# EAGLE design SNES-3Chip_MR_QID (EAGLE 6.4)
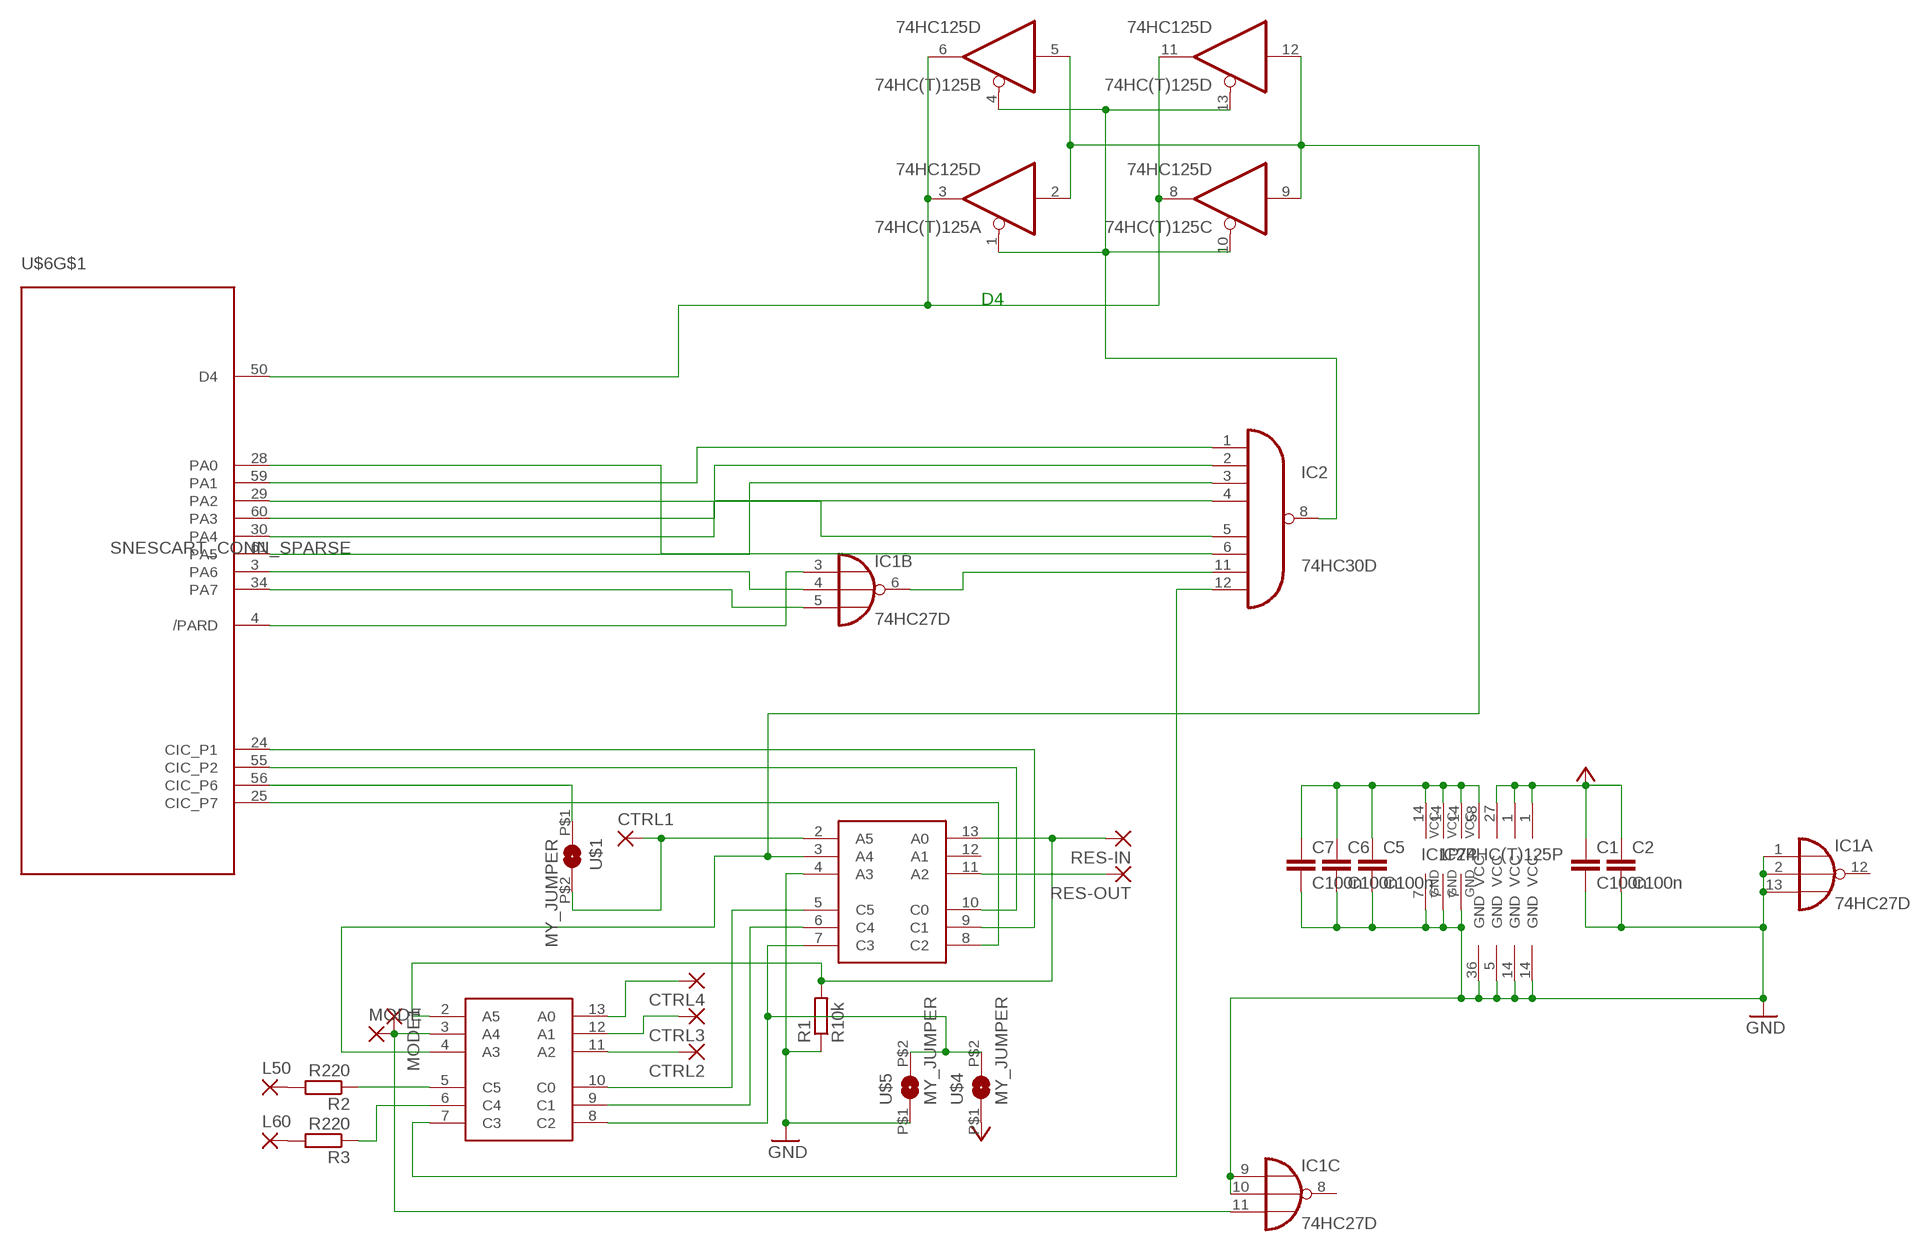
[diagram p0: schematic, sheet 1]

## Parts
74HC(T)125  74HC125D  [SO14]
C1  C100n  C0805  [Z0805]
C2  C100n  C0805  [Z0805]
C5  C100n  C0805  [Z0805]
C6  C100n  C0805  [Z0805]
C7  C100n  C0805  [Z0805]
CTRL1  SMD2  [SMD1,27-2,54]
CTRL2  SMD2  [SMD1,27-2,54]
CTRL3  SMD2  [SMD1,27-2,54]
CTRL4  SMD2  [SMD1,27-2,54]
IC1  74HC27D  [SO14]
IC2  74HC30D  [SO14]
L50  SMD2  [SMD1,27-2,54]
L60  SMD2  [SMD1,27-2,54]
MODE  SMD2  [SMD1,27-2,54]
MODE1  SMD2  [SMD1,27-2,54]
R1  R10k  R0805  [Z0805]
R2  R220  R0805  [Z0805]
R3  R220  R0805  [Z0805]
RES-IN  SMD2  [SMD1,27-2,54]
RES-OUT  SMD2  [SMD1,27-2,54]
U$1  MY_JUMPER  [MYJUMP]
U$2  PIC16F630_SIMPLE  [PIC16F630]
U$3  PIC16F630_SIMPLE  [PIC16F630]
U$4  MY_JUMPER  [MYJUMP]
U$5  MY_JUMPER  [MYJUMP]
U$6  SNESCART_CONN_SPARSE  [SNESCART_CONN_SPARSE]

## Nets
GND: 74HC(T)125.7(P:GND) C1.2 C2.2 C5.2 C6.2 C7.2 IC1.1(A:I0) IC1.2(A:I1) IC1.7(P:GND) IC1.9(C:I0) IC1.10(C:I1) IC1.13(A:I2) IC2.7(GND) R1.1 U$2.4(A3) U$2.14(GND) U$3.14(GND) U$5.P$1 U$6.5(GND) U$6.36(GND)
N$2: 74HC(T)125.1(A:OE) 74HC(T)125.4(B:OE) 74HC(T)125.10(C:OE) 74HC(T)125.13(D:OE) IC2.8(O)
N$3: RES-OUT.1(P) U$2.11(A2)
N$4: IC2.3(I2) U$6.61(PA5)
N$5: IC2.2(I1) U$6.60(PA3)
N$6: IC1.3(B:I0) U$6.4(/PARD)
N$7: IC1.4(B:I1) U$6.3(PA6)
N$8: IC1.6(B:O) IC2.11(I6)
N$9: IC2.6(I5) U$6.28(PA0)
N$10: R1.2 RES-IN.1(P) U$2.13(A0) U$3.2(A5)
N$11: L50.1(P) R2.2
N$12: R2.1 U$3.5(C5)
N$13: R3.1 U$3.6(C4)
N$14: IC1.11(C:I2) MODE1.1(P) MODE.1(P) U$3.3(A4)
N$15: L60.1(P) R3.2
N$16: IC1.5(B:I2) U$6.34(PA7)
N$17: IC2.12(I7) U$3.7(C3)
N$18: U$1.P$1 U$6.56(CIC_P6)
N$19: U$2.5(C5) U$3.10(C0)
N$20: IC2.1(I0) U$6.59(PA1)
N$21: IC2.5(I4) U$6.29(PA2)
N$22: IC2.4(I3) U$6.30(PA4)
N$33: CTRL2.1(P) U$3.11(A2)
N$34: CTRL3.1(P) U$3.12(A1)
N$39: CTRL1.1(P) U$1.P$2 U$2.2(A5)
N$42: 74HC(T)125.3(A:O) 74HC(T)125.6(B:O) 74HC(T)125.8(C:O) 74HC(T)125.11(D:O) U$6.50(D4)
N$46: CTRL4.1(P) U$3.13(A0)
N$48: U$2.10(C0) U$6.55(CIC_P2)
N$49: U$2.9(C1) U$6.24(CIC_P1)
N$51: U$2.8(C2) U$6.25(CIC_P7)
N$52: U$2.6(C4) U$3.9(C1)
N$53: U$2.7(C3) U$3.8(C2) U$4.P$2 U$5.P$2
UIGR: 74HC(T)125.2(A:I) 74HC(T)125.5(B:I) 74HC(T)125.9(C:I) 74HC(T)125.12(D:I) U$2.3(A4) U$3.4(A3)
VCC: C1.1 C2.1 U$2.1(VCC) U$3.1(VCC) U$4.P$1 U$6.27(VCC)
VCC_2: 74HC(T)125.14(P:VCC) C5.1 C6.1 C7.1 IC1.14(P:VCC) IC2.14(VCC) U$6.58(VCC)
Unconnected: IC1.8(C:O) IC1.12(A:O) U$2.12(A1)

## Notes on the sheet
- D4

## Library data of the parts
74HC(T)125 = 74xx-eu:74*125: Quad bus BUFFER, 3-state
C1 C2 C5-C7 = snescart:C0805
CTRL1-CTRL4 L50 L60 MODE MODE1 RES-IN RES-OUT = wirepad:SMD2: SMD PAD
IC1 = 74xx-eu:74*27: Triple 3-input NOR gate
IC2 = 74xx-eu:74*30: 8-input NAND gate
R1-R3 = snescart:R0805
U$1 U$4 U$5 = snescart:MY_JUMPER
U$2 U$3 = snescart:PIC16F630_SIMPLE
U$6 = snes_div:SNESCART_CONN_SPARSE

## Board
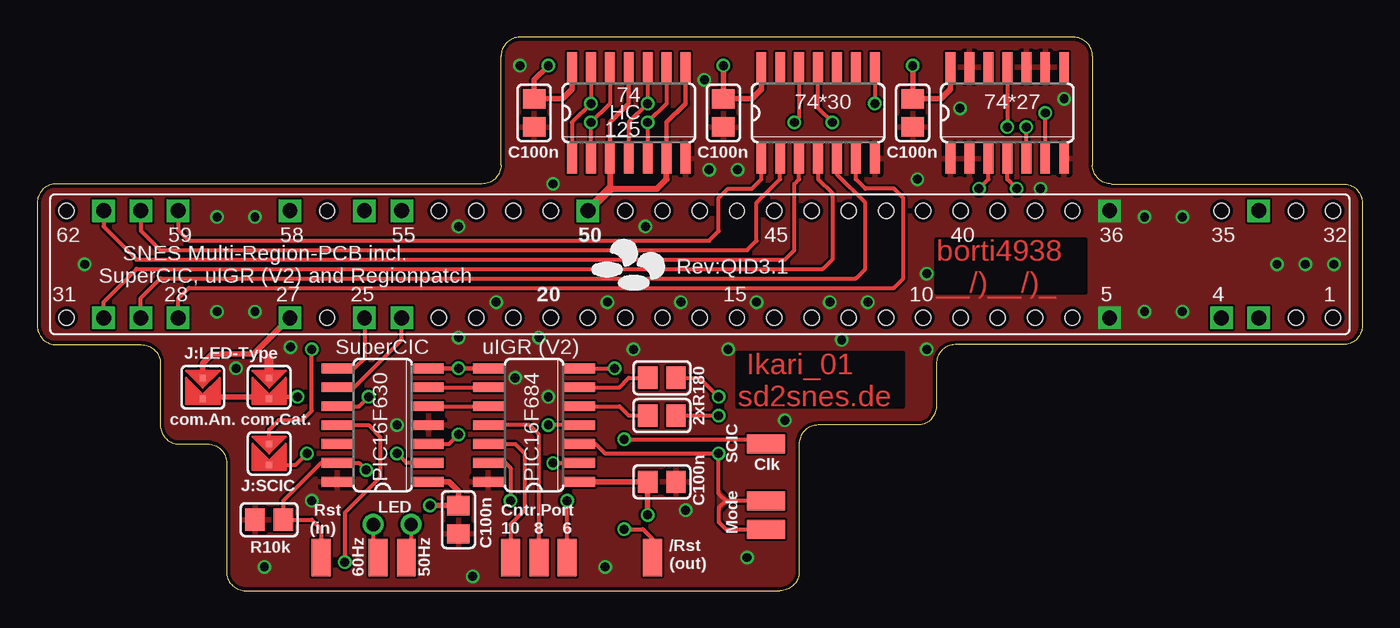
[diagram p1: board, top side]
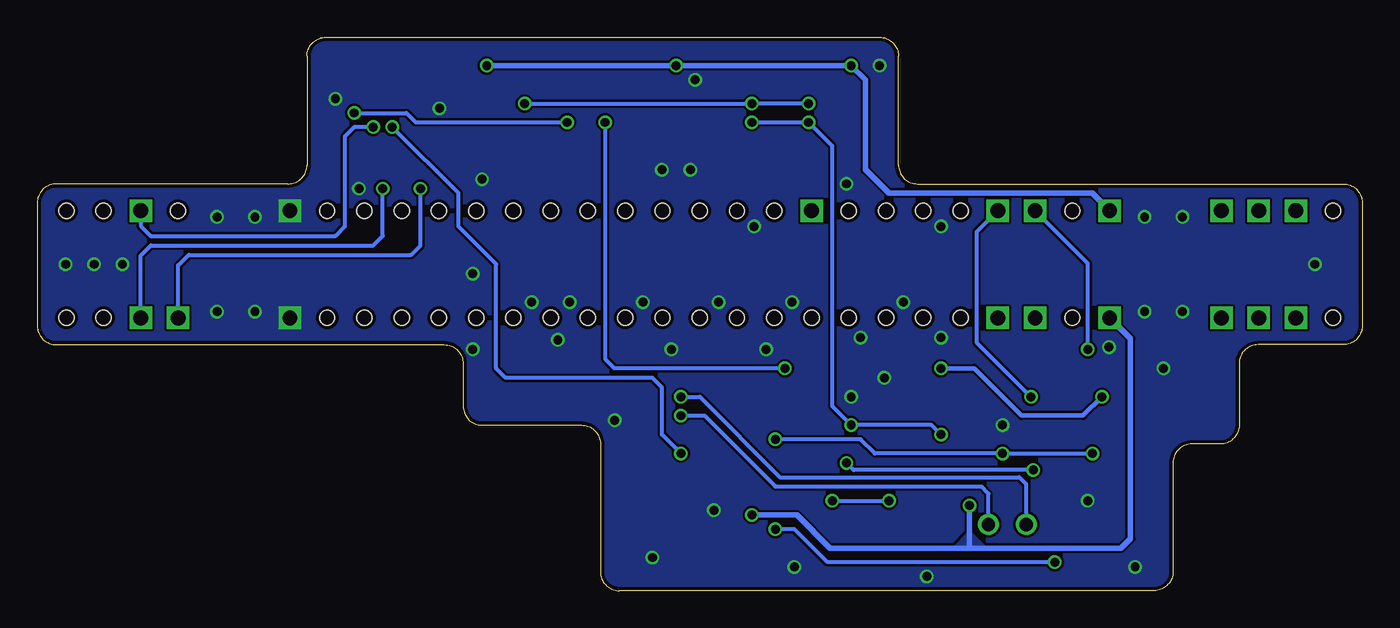
[diagram p2: board, bottom side, seen from below]

Size 88.9 x 37.15 mm. Coordinates in mm from the lower left corner, seen from the top.
Outline: 72.07,27.3 arc-90 70.8,28.58 70.8,35.88 arc90 69.53,37.15 32.38,37.15 arc90 31.11,35.88 31.11,28.58 arc-90 29.84,27.3 1.27,27.3 arc90 0,26.04 0,17.78 arc90 1.27,16.51 6.99,16.51 arc-90 8.26,15.24 8.26,11.11 arc90 9.53,9.84 11.43,9.84 arc-90 12.7,8.57 12.7,1.27 arc90 13.97,0 49.85,0 arc90 51.12,1.27 51.12,9.84 arc-90 52.39,11.11 59.05,11.11 arc90 60.32,12.38 60.32,15.24 arc-90 61.59,16.51 87.63,16.51 arc90 88.9,17.78 88.9,26.04 arc90 87.63,27.3 72.07,27.3
Copper layers (1*16): Top 0.035mm / dielectric 1.5mm / Bottom 0.035mm
Design rules "ITEADstudio_DRC": minimum track width 6mil, minimum drill 12mil, track to track 6mil, track to pad 6mil, pad to pad 6mil, via to via 6mil, smd to smd 0mil, copper to edge 10mil, drill to drill 10mil, minimum pad ring 10mil, minimum via ring 6mil, stop-mask expansion 2mil, vias tented up to drill 30mil, thermal gap 10mil
tRestrict: 3 lines

### Footprints (pad centres in the part's own frame; a part is rotated, then mirrored left to right if it is on the bottom)
SO14 = smd 0.66 x 2.032: 1 -3.81,-3.073; 2 -2.54,-3.073; 3 -1.27,-3.073; 4 0,-3.073; 5 1.27,-3.073; 6 2.54,-3.073; 7 3.81,-3.073; 8 3.81,3.073; 9 2.54,3.073; 10 1.27,3.073; 11 0,3.073; 12 -1.27,3.073; 13 -2.54,3.073; 14 -3.81,3.073
Z0805 = smd 1.3 x 1.5: 1 -0.95,0; 2 0.95,0
SMD1,27-2,54 = smd 1.27 x 2.54: 1 0,0
MYJUMP = smd 0.406 x 0.406: P$1 -0.635,0; P$2 0.765,0
PIC16F630 = smd 0.66 x 2.032: 1 -3.81,-3.073; 2 -2.54,-3.073; 3 -1.27,-3.073; 4 0,-3.073; 5 1.27,-3.073; 6 2.54,-3.073; 7 3.81,-3.073; 8 3.81,3.073; 9 2.54,3.073; 10 1.27,3.073; 11 0,3.073; 12 -1.27,3.073; 13 -2.54,3.073; 14 -3.81,3.073
SNESCART_CONN_SPARSE = drill 1 square: 3 -3.6,-37.5; 4 -3.6,-35; 5 -3.6,-27.5; 24 -3.6,20; 25 -3.6,22.5; 27 -3.6,27.5; 28 -3.6,35; 29 -3.6,37.5; 30 -3.6,40; 34 3.6,-37.5; 36 3.6,-27.5; 50 3.6,7.5; 55 3.6,20; 56 3.6,22.5; 58 3.6,27.5; 59 3.6,35; 60 3.6,37.5; 61 3.6,40 | hole 1: -3.6,-42.5; -3.6,-40; -3.6,-25; -3.6,-22.5; -3.6,-20; -3.6,-17.5; -3.6,-15; -3.6,-12.5; -3.6,-10; -3.6,-7.5; -3.6,-5; -3.6,-2.5; -3.6,0; -3.6,2.5; -3.6,5; -3.6,7.5; -3.6,10; -3.6,12.5; -3.6,15; -3.6,17.5; -3.6,25; -3.6,42.5; 3.6,42.5; 3.6,25; 3.6,17.5; 3.6,15; 3.6,12.5; 3.6,10; 3.6,5; 3.6,2.5; 3.6,0; 3.6,-2.5; 3.6,-5; 3.6,-7.5; 3.6,-10; 3.6,-12.5; 3.6,-15; 3.6,-17.5; 3.6,-20; 3.6,-22.5; 3.6,-25; 3.6,-35; 3.6,-40; 3.6,-42.5

### Placement (x,y rotation side)
74HC(T)125  39.69,32.07 0 top
C1  41.91,7.3 0 top
C2  28.26,4.76 270 top
C5  33.34,32.07 270 top
C6  46.04,32.07 270 top
C7  58.74,32.07 270 top
CTRL1  48.89,9.84 90 top
CTRL2  33.65,2.22 0 top
CTRL3  31.75,2.22 0 top
CTRL4  35.56,2.22 0 top
IC1  65.09,32.07 0 top
IC2  52.39,32.07 0 top
L50  24.77,2.22 0 top
L60  22.86,2.22 0 top
MODE  48.89,4.13 90 top
MODE1  48.89,6.03 90 top
R1  15.56,4.76 0 top
R2  41.91,11.75 0 top
R3  41.91,14.29 0 top
RES-IN  19.05,2.22 0 top
RES-OUT  41.27,2.22 180 top
U$1  15.56,9.21 270 top
U$2  23.18,11.11 90 top
U$3  33.34,11.11 90 top
U$4  11.11,13.65 270 top
U$5  15.56,13.65 270 top
U$6  44.45,21.91 90 top

### Tracks (layer width: path | path; a pad name or v marks a point on that pad's centre or on a via)
GND  (via drill 0.6)
  Top 0.61: U$5.P$1 15.56,15.56
  other vias: 24.13,11.11 83.19,21.91 87,21.91 47.62,2.22 55.72,19.37 76.84,18.73 68.9,33.02 34.61,27.3 3.18,21.91 46.35,16.19 74.3,18.73 85.09,21.91 45.08,28.26 13.34,14.92 12.07,25.08 15.24,1.59 12.07,18.73 14.61,25.08 28.26,24.45 59.05,27.62 40,16.19 74.3,25.08 53.18,19.37 53.97,16.83 34.29,13.02 32.07,14.29 46.99,28.26 50.16,11.43 16.99,16.35 38.1,1.59 76.84,25.08 14.61,18.73 30.8,19.37 43.5,5.4 67.31,26.99 61.91,32.38 44.77,34.29 48.26,19.37 43.18,19.37 18.41,6.03 29.21,0.95 32.38,35.24 38.26,19.37 40.8,24.45 28.26,16.99 33.65,16.99 59.69,16.19 59.69,21.27
  pour Top (rank 2): -1.27,-6.03 90.17,-6.03 90.17,39.69 -1.27,39.69
  pour Bottom (rank 2): -1.27,39.69 90.17,39.69 90.17,-6.03 -1.27,-6.03
  pour Bottom (rank 2, no thermals): 69.85,26.99 73.66,26.99 73.66,16.99 69.85,16.99
  pour Top (rank 2, no thermals): 69.85,26.99 73.66,26.99 73.66,17.14 69.85,17.14
N$2  (via drill 0.6)
  Top 0.254: 74HC(T)125.13 v37.15,32.7 35.88,31.43 74HC(T)125.1 | 74HC(T)125.10 v40.96,32.7 39.69,31.43 74HC(T)125.4 | IC2.8 v56.2,32.7
  Bottom 0.254: v37.15,32.7 v40.96,32.7 v56.2,32.7
N$3  (via drill 0.6)
  Top 0.254: U$2.11 22.23,11.11 23.02,10.32 23.02,7.62 20.64,5.24 v20.64,1.91 | v39.37,4.13 40.64,4.13 41.27,3.49 RES-OUT.1
  Bottom 0.254: v20.64,1.91 35.88,1.91 38.1,4.13 v39.37,4.13
N$4
  Top 0.254: U$6.61 4.45,24.45 6.67,22.23 50.16,22.23 50.8,22.86 50.8,27.3 51.12,27.62 IC2.3
  Top 0.305: U$6.61
N$5
  Top 0.254: U$6.60 6.95,24.17 8.26,22.86 47.62,22.86 48.26,23.49 48.26,26.04 49.85,27.62 IC2.2
N$6  (via drill 0.6)
  Top 0.254: v63.18,26.99 63.82,27.62 IC1.3
  Bottom 0.254: U$6.4 79.45,21.83 78.74,22.54 63.82,22.54 63.18,23.18 v63.18,26.99
N$7  (via drill 0.6)
  Top 0.254: v65.72,26.99 65.09,27.62 IC1.4
  Bottom 0.254: U$6.3 81.95,22.51 81.28,23.18 66.36,23.18 65.72,23.81 v65.72,26.99
N$8  (via drill 0.6)
  Top 0.254: v53.34,31.43 52.39,32.38 IC2.11 | IC1.6 v67.63,32.07
  Bottom 0.254: v67.63,32.07 64.14,32.07 63.5,31.43 v53.34,31.43
N$9
  Top 0.254: U$6.28 9.45,19.61 10.16,20.32 57.47,20.32 58.1,20.96 58.1,26.35 57.47,26.99 55.56,26.99 54.93,27.62 IC2.6
N$10  (via drill 0.6)
  Top 0.254: RES-IN.1 19.05,4.13 18.41,4.76 R1.2 16.51,6.03 19.05,8.57 U$2.13 21.59,8.57 v22.07,8.1 | v34.61,8.57 U$3.2
  Bottom 0.254: v22.07,8.1 34.13,8.1 v34.61,8.57
N$11  (via drill 0.6, 0.9 pad 1.42)
  Top 0.254: R2.2 v45.72,11.75 | v25.08,4.44 25.08,2.54 L50.1
  Bottom 0.254: v45.72,11.75 44.13,11.75 39.37,6.99 25.56,6.99 25.08,6.51 v25.08,4.44
N$12
  Top 0.254: U$3.5 39.05,12.38 39.69,11.75 R2.1
N$13
  Top 0.254: U$3.6 39.05,13.65 39.69,14.29 R3.1
N$14  (via drill 0.6)
  Top 0.254: U$3.3 37.46,9.84 38.1,9.21 v45.72,9.21 45.72,6.51 46.2,6.03 | IC1.11 v65.09,31.12 | 46.2,6.03 45.72,5.56 45.72,4.6 46.2,4.13 MODE.1 | MODE1.1 46.2,6.03
  Bottom 0.254: v65.09,31.12 60.64,26.67 60.64,24.45 58.1,21.91 58.1,14.92 57.47,14.29 47.62,14.29 46.99,13.65 46.99,10.48 v45.72,9.21
  pour Top: 45.72,6.67 45.72,5.4 46.35,6.03
N$15  (via drill 0.6, 0.9 pad 1.42)
  Top 0.254: R3.2 44.45,14.29 v45.72,13.02 | v22.54,4.44 22.54,2.54 L60.1
  Bottom 0.254: v45.72,13.02 44.45,13.02 39.05,7.62 23.02,7.62 22.54,7.14 v22.54,4.44
N$16  (via drill 0.6)
  Top 0.254: IC1.5 v66.36,31.12
  Bottom 0.254: v66.36,31.12 67.63,31.12 68.26,30.48 68.26,24.45 68.9,23.81 81.28,23.81 81.95,24.48 U$6.34
N$17  (via drill 0.6)
  Top 0.254: U$3.7 v38.73,14.92 | IC2.12 51.12,31.75 v50.8,31.43
  Bottom 0.254: v38.73,14.92 50.16,14.92 50.8,15.56 v50.8,31.43
N$18  (via drill 0.6)
  Top 0.254: U$1.P$1 15.56,10.8 16.19,11.43 17.78,11.43 18.41,12.07 v18.41,16.19
  Bottom 0.254: v18.41,16.19 18.41,21.97 U$6.56
N$19
  Top 0.254: U$2.5 U$3.10
N$20
  Top 0.254: U$6.59 9.45,24.21 10.16,23.49 45.08,23.49 45.72,24.13 45.72,26.35 46.35,26.99 47.94,26.99 48.58,27.62 IC2.1
N$21
  Top 0.254: U$6.29 6.95,19.65 8.26,20.96 54.93,20.96 55.56,21.59 55.56,26.04 53.66,27.94 IC2.5
N$22
  Top 0.254: U$6.30 4.45,19.37 6.67,21.59 52.7,21.59 53.34,22.23 53.34,26.67 52.39,27.62 IC2.4
N$33
  Top 0.254: CTRL2.1 33.65,10.48 33.02,11.11 U$3.11
N$34
  Top 0.254: U$3.12 32.07,9.84 32.7,9.21 32.7,5.4 31.75,4.44 CTRL3.1
N$39  (via drill 0.6)
  Top 0.254: U$2.2 24.77,8.57 v24.13,9.21 | U$1.P$2 17.33,8.44 v18.1,9.21 | v39.37,10.16 48.58,10.16 CTRL1.1
  Bottom 0.254: v18.1,9.21 v24.13,9.21 32.7,9.21 33.65,10.16 v39.37,10.16
N$42
  Top 0.305: 74HC(T)125.3 38.42,31.43 39.69,32.7 74HC(T)125.11 | 74HC(T)125.6 42.23,31.43 43.5,32.7 74HC(T)125.8 43.5,34.93
  Top 0.406: 74HC(T)125.6 42.23,27.62 41.59,26.99 38.42,26.99 74HC(T)125.3
  Top 0.61: U$6.50 36.95,25.52 38.42,26.99
N$46  (via drill 0.6)
  Top 0.254: U$3.13 31.43,8.57 31.75,8.25 v31.75,6.03 | CTRL4.1 v35.56,6.03
  Bottom 0.254: v35.56,6.03 v31.75,6.03
N$48  (via drill 0.6)
  Top 0.254: U$2.10 21.59,12.38 v22.23,13.02
  Bottom 0.254: U$6.55 25.88,24.08 25.88,16.67 v22.23,13.02
N$49
  Top 0.254: U$2.9 21.27,13.65 24.45,16.83 U$6.24
N$51
  Top 0.254: U$6.25 21.95,15.6 21.27,14.92 U$2.8
N$52
  Top 0.254: U$2.6 U$3.9
N$53  (via drill 0.6)
  Top 0.305: U$2.7 v28.26,14.92 U$3.8 | v17.46,13.02 15.88,13.02 15.75,12.89 U$5.P$2 15.43,13.02 | U$4.P$2 11.3,12.89 11.43,13.02
  Top 0.356: 11.43,13.02 15.43,13.02
  Bottom 0.305: v17.46,13.02 18.73,11.75 22.86,11.75 26.04,14.92 v28.26,14.92
UIGR  (via drill 0.6)
  Top 0.254: U$3.4 v34.29,11.11 | 74HC(T)125.9 42.23,32.7 v40.96,31.43 74HC(T)125.5 | 74HC(T)125.2 v37.15,31.43 38.42,32.7 74HC(T)125.12 | U$2.3 27.62,9.84 v28.26,10.48
  Bottom 0.254: v28.26,10.48 28.89,11.11 v34.29,11.11 35.56,12.38 35.56,29.84 v37.15,31.43 v40.96,31.43
VCC  (via drill 0.6)
  Top 0.356: U$3.1 C1.1 v40.96,5.08 | U$2.1 27.62,7.3 28.26,6.67 C2.1 26.99,5.72 v26.35,5.72 | U$4.P$1 11.11,15.24 11.75,15.87 14.52,15.87 U$6.27
  Bottom 0.305: v40.96,5.08
  Bottom 0.356: U$6.27 15.56,16.92 15.56,3.49 16.19,2.86 26.35,2.86 | 26.35,2.86 35.72,2.86 37.94,5.08 v40.96,5.08 | v26.35,5.72 26.35,2.86
  pour Bottom: 25.4,2.86 26.35,3.81 27.3,2.86
VCC_2  (via drill 0.6)  (1 unrouted)
  Top 0.305: C7.1 | C5.1 | C6.1
  Top 0.356: v58.74,35.24 C7.1 | IC1.14 61.28,33.66 60.64,33.02 C7.1 | IC2.14 48.58,33.66 47.94,33.02 C6.1 | 74HC(T)125.14 35.88,33.66 35.24,33.02 C5.1 33.34,34.29 v34.29,35.24 | C6.1 v46.04,35.24
  Bottom 0.356: v58.74,35.24 v46.04,35.24 v34.29,35.24 33.34,34.29 33.34,28.26 31.75,26.67 18.1,26.67 16.95,25.52

### Text on the board
Top: borti4938 / __/)__/)_ | Ikari_01 / sd2snes.de
tNames: 74 / HC / 125 | 74*30 | 74*27 | C100n | C100n | C100n | SNES Multi-Region-PCB incl. / SuperCIC, uIGR (V2) and Regionpatch | Rev:QID3.1 | J:LED-Type | SuperCIC | uIGR (V2) | com.An. | com.Cat. | 2xR180 | SCIC | Clk | J:SCIC | PIC16F630 | PIC16F684 | LED | Rst / (in) | Cntr.Port / 10 | 8 | 6 | Mode | C100n | 60Hz | 50Hz | /Rst / (out)
tStop: b | o | r | t | i | 4 | 9 | 3 | 8 | _ | _ | / | ) | _ | _ | / | ) | _ | I | k | a | r | i | _ | 0 | 1 | s | d | 2 | s | n | e | s | . | d | e